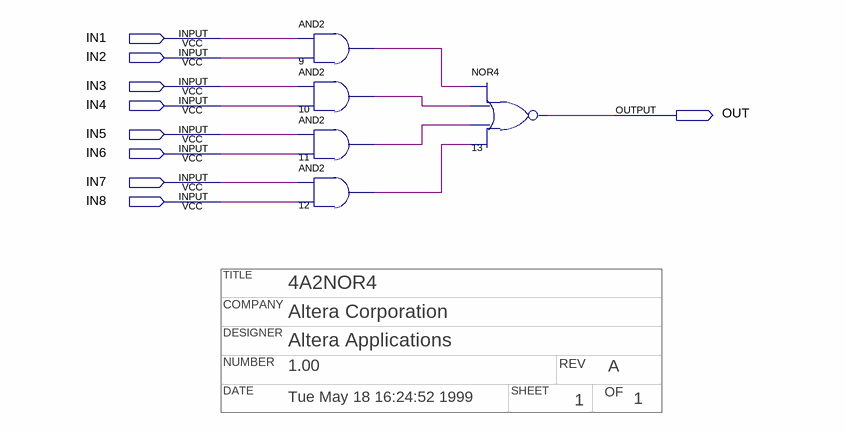
[diagram p0: schematic sheet]
// Quartus schematic 4a2nor4.bdf as structural Verilog: 5 symbols, 9 pins
// Title block: TITLE: 4A2NOR4; COMPANY: Altera Corporation; DESIGNER: Altera Applications; NUMBER: 1.00; REV: A; DATE: Tue May 18 16:24:52 1999; SHEET: 1; OF: 1
module \4a2nor4  (
  input  IN1,
  input  IN2,
  input  IN3,
  input  IN4,
  input  IN5,
  input  IN6,
  input  IN7,
  input  IN8,
  output OUT
);

  wire n9_out, n10_out, n11_out, n12_out;

  and u_9 (n9_out, IN1, IN2);
  and u_10 (n10_out, IN3, IN4);
  and u_11 (n11_out, IN5, IN6);
  and u_12 (n12_out, IN7, IN8);
  nor u_13 (OUT, n9_out, n10_out, n11_out, n12_out);
endmodule
